# EAGLE board mainboard_split IO_FPGA_8x2-1a (EAGLE 9.6.2), part 1 of 2
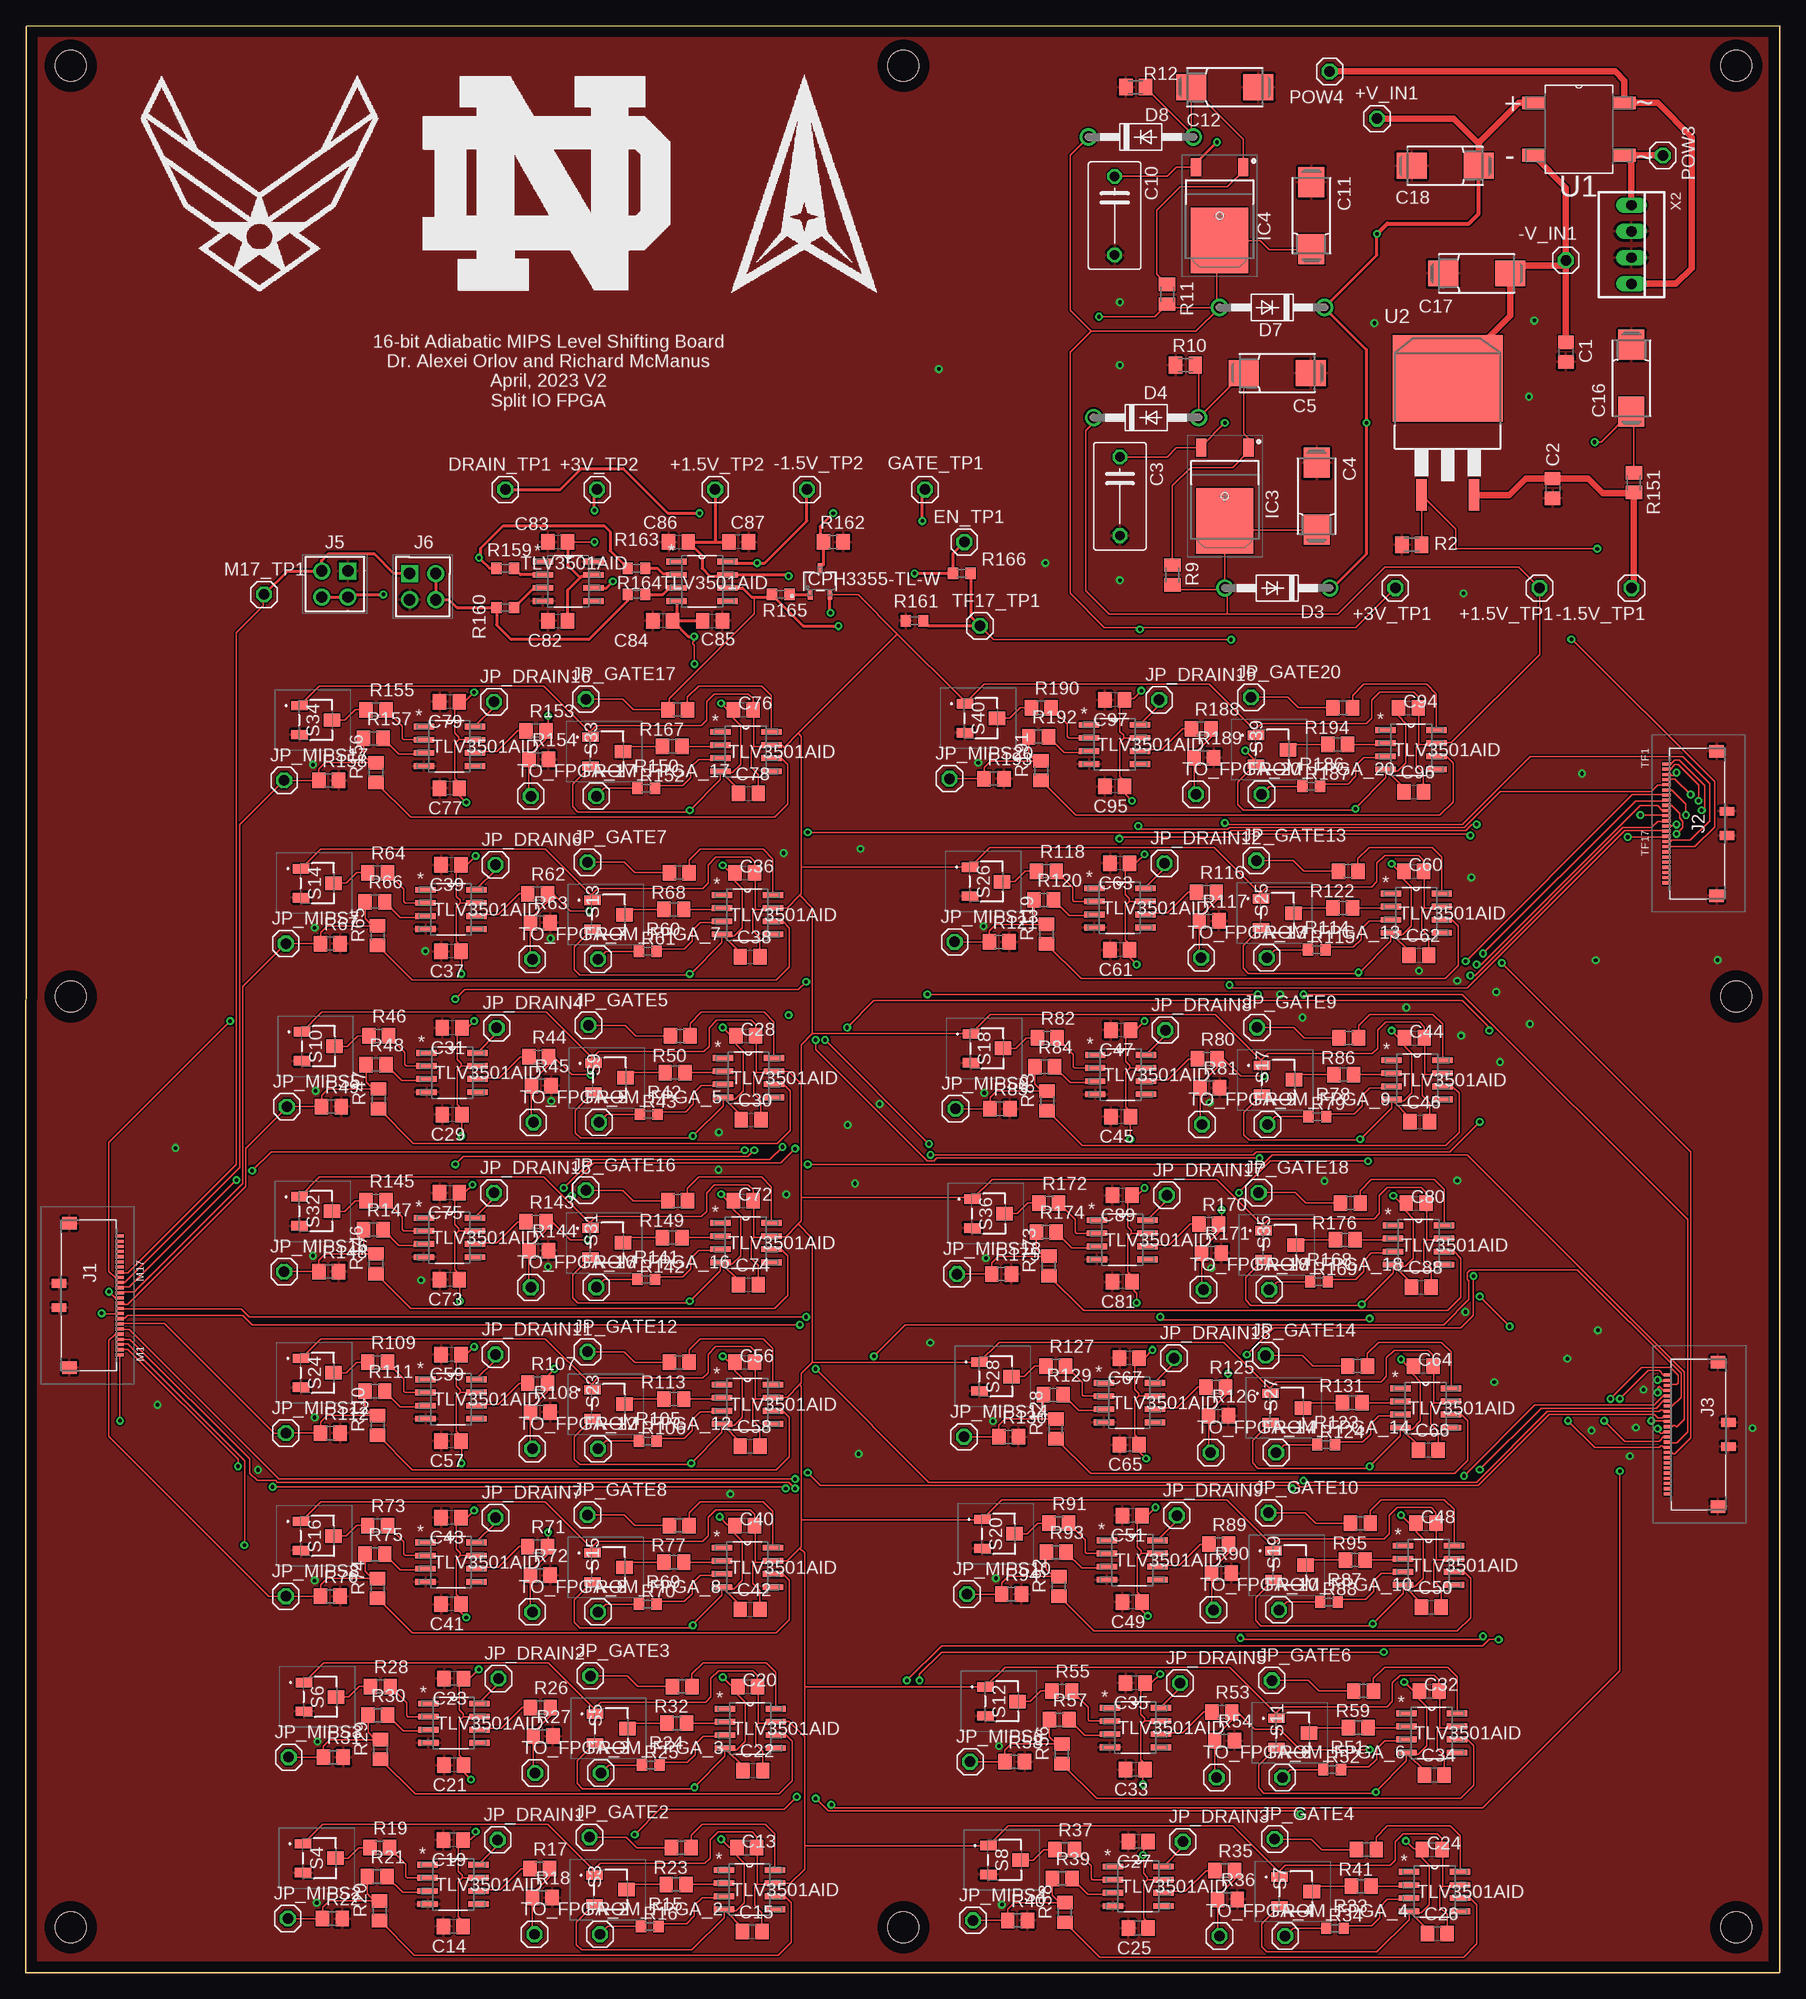
[diagram p17: board, top side]
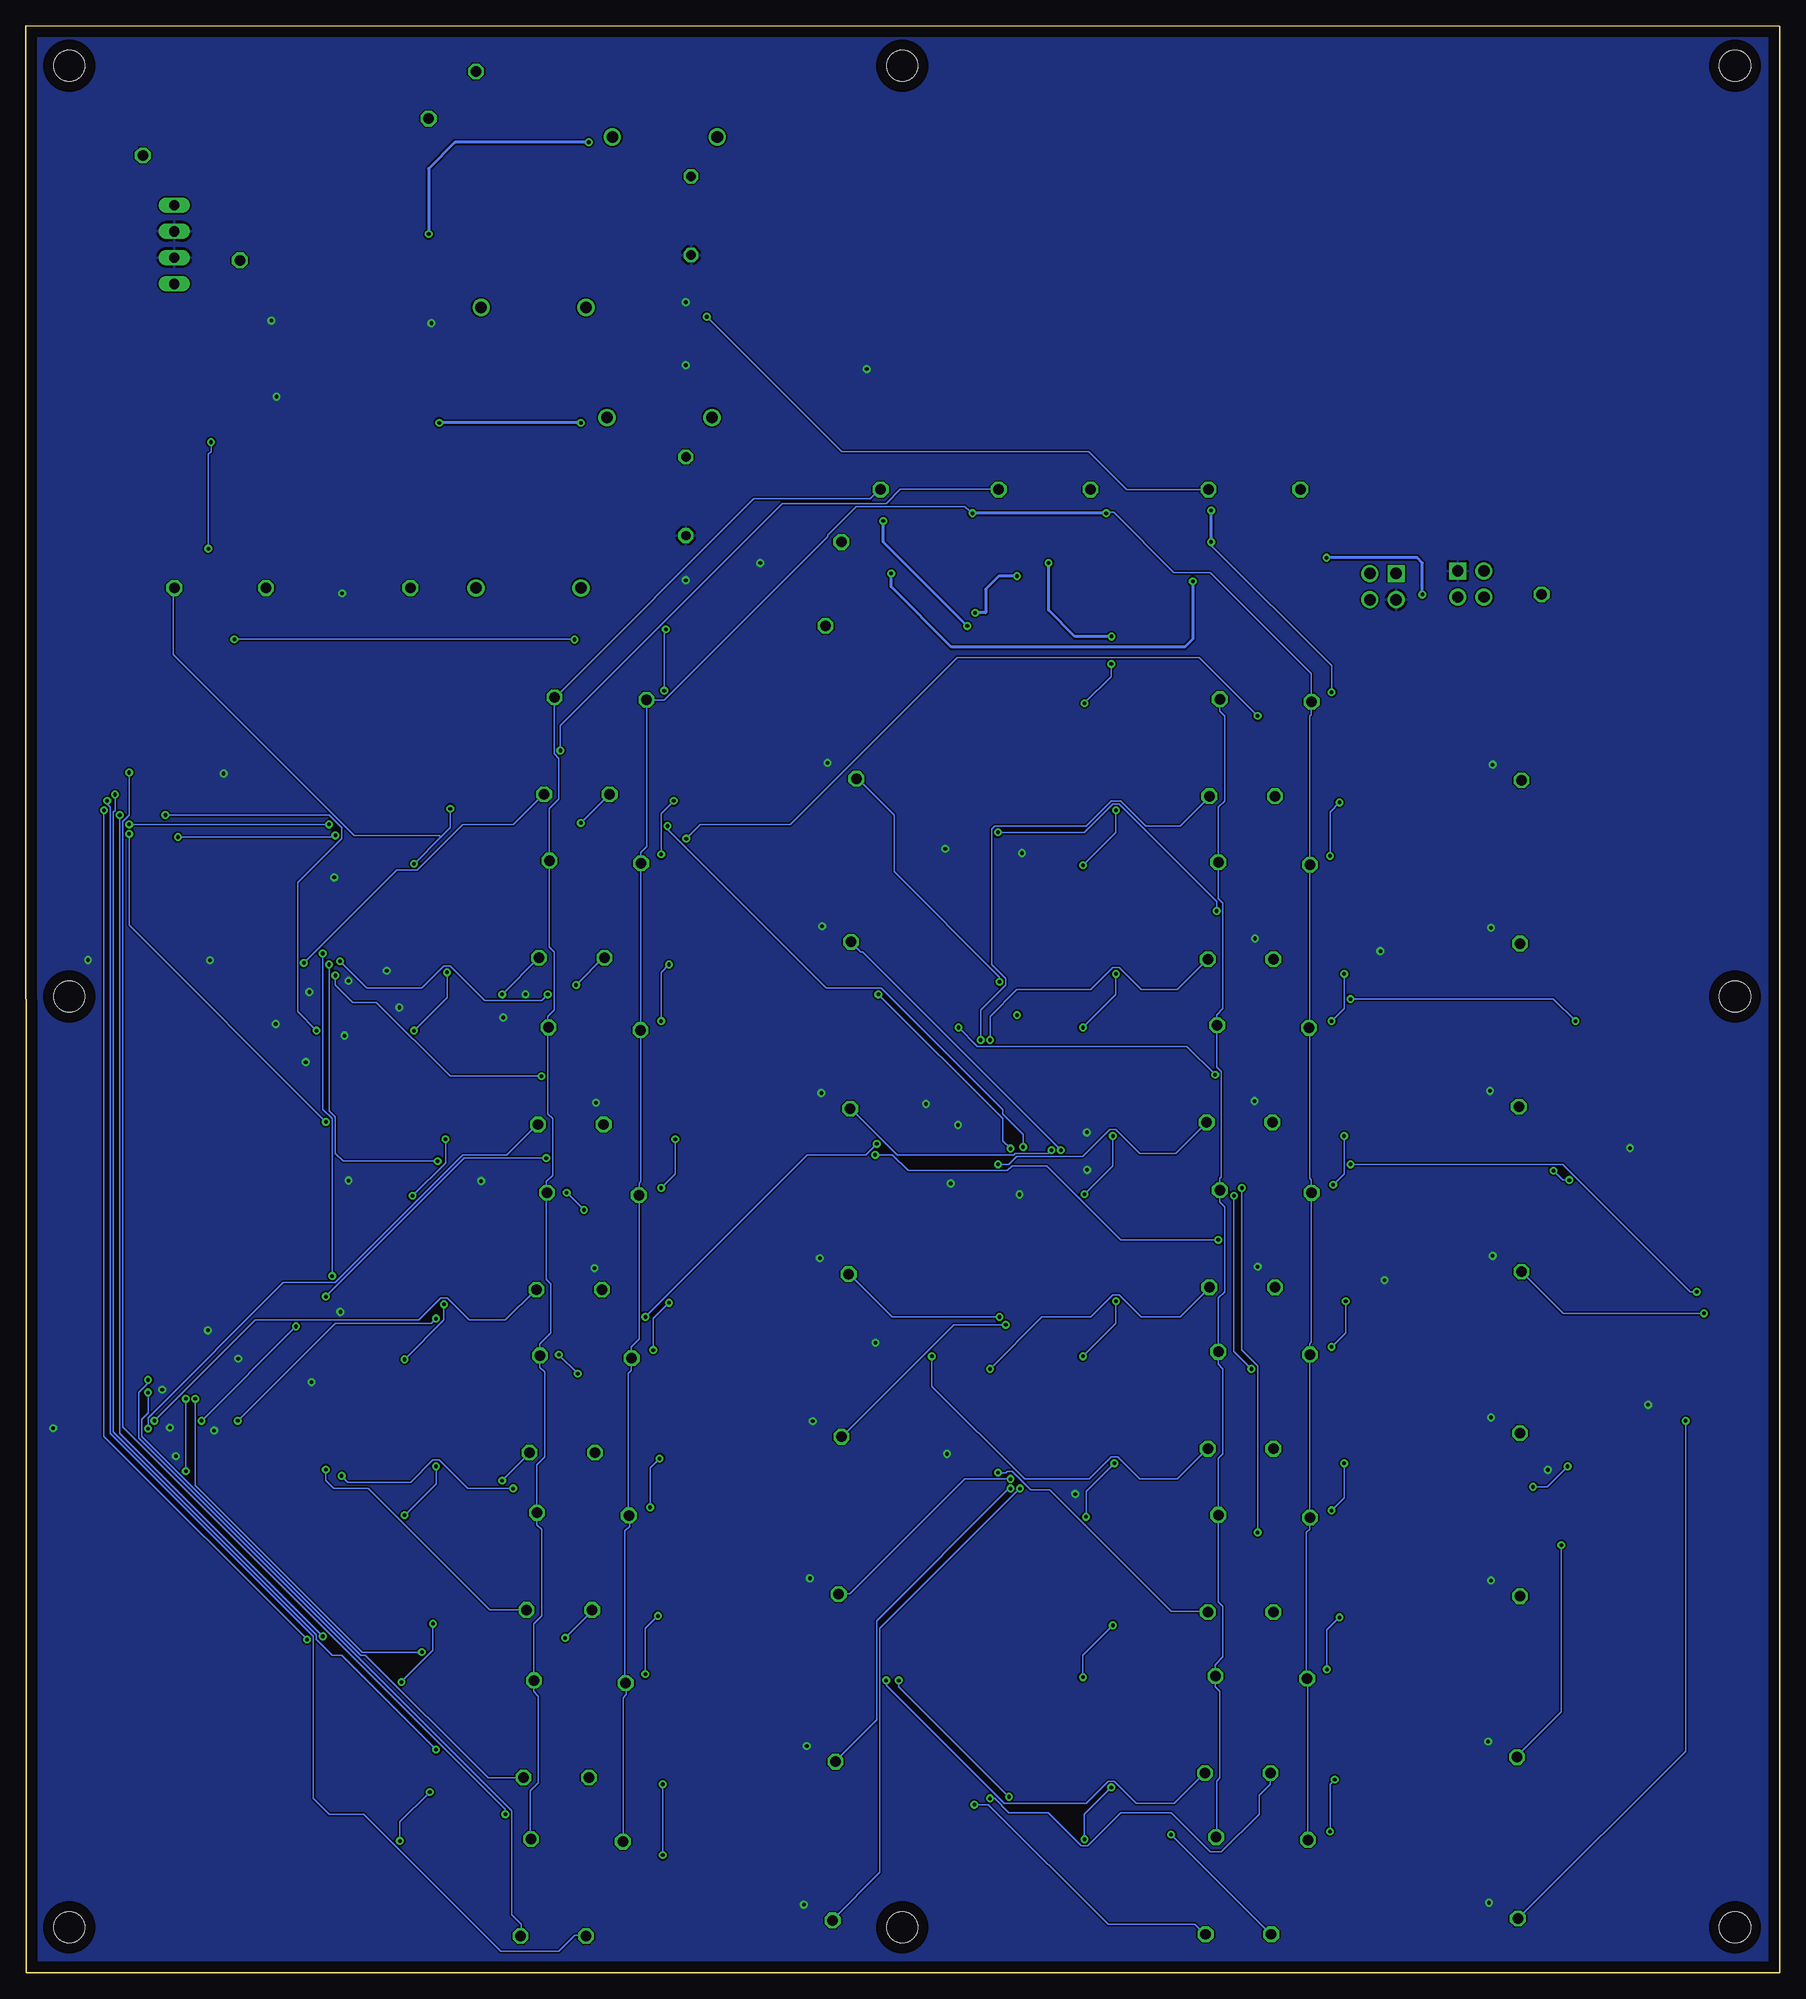
[diagram p18: board, bottom side, seen from below]

Size 169.85 x 188.59 mm. Coordinates in mm from the lower left corner, seen from the top.
Outline: 0,0 169.82,0.02 169.85,188.59 0.03,188.57 0,0
Copper layers (1*16): Top 0.035mm / dielectric 1.5mm / Bottom 0.035mm
Design rules "default *": minimum track width 6mil, minimum drill 0.35mm, track to track 6mil, track to pad 6mil, pad to pad 6mil, via to via 6mil, smd to smd 6mil, copper to edge 40mil, drill to drill 6mil, minimum pad ring 10mil, minimum via ring 8mil, stop-mask expansion 4mil, vias tented up to drill 15mil, thermal gap 10mil
Holes 3 mm at 165.63,4.41 4.34,4.41 84.99,4.41 4.34,184.75 165.63,184.75 84.99,184.75 4.34,94.58 165.63,94.58

## Footprints (pad centres in the part's own frame; a part is rotated, then mirrored left to right if it is on the bottom)
1X01 = drill 1.016 octagon: 1 0,0
C0805 = smd 1.3 x 1.5: 1 -0.95,0; 2 0.95,0
C075-052X106 = drill 0.914 octagon: 1 -3.81,0; 2 3.81,0
085CS_1AR = smd 2.9 x 2.5: + 3.25,0; - -3.25,0
DO41-10 = drill 1.118: A 5.08,0; C -5.08,0
TO228P991X238-3N = smd 1.75 x 1: 1 -4.7,2.285; 3 -4.7,-2.285 | smd 6.35 x 5.55: 4 2.4,0
5022442430 = smd 0.3 x 0.8: 1 5.75,3.08; 2 5.25,3.08; 3 4.75,3.08; 4 4.25,3.08; 5 3.75,3.08; 6 3.25,3.08; 7 2.75,3.08; 8 2.25,3.08; 9 1.75,3.08; 10 1.25,3.08; 11 0.75,3.08; 12 0.25,3.08; 13 -0.25,3.08; 14 -0.75,3.08; 15 -1.25,3.08; 16 -1.75,3.08; 17 -2.25,3.08; 18 -2.75,3.08; 19 -3.25,3.08; 20 -3.75,3.08; 21 -4.25,3.08; 22 -4.75,3.08; 23 -5.25,3.08; 24 -5.75,3.08 | smd 1.22 x 1.4: 25 -6.99,-1.77; 28 6.99,-1.77 | smd 0.85 x 1.4: 26 -1.175,-2.78; 27 1.175,-2.78
HDRV4W64P254_2X2_521X508X851P = drill 1.1 pad 1.65 square: 1 0,0 | drill 1.1 pad 1.65: 2 0,2.54; 3 2.54,0; 4 2.54,2.54
M0805 = smd 1.3 x 1.6: 1 -0.95,0; 2 0.95,0
R0805 = smd 1.3 x 1.5: 1 -0.95,0; 2 0.95,0
R0603 = smd 1 x 1.1: 1 -0.85,0; 2 0.85,0
SM3TW102 = smd 0.9 x 1.6: 1 -1.4,-1.56; 3 1.4,-1.56 | smd 1.3 x 1.6: 2 0,1.56
SOT508P985X260-4N = smd 2.235 x 1.245: 1 -4.394,2.54; 2 -4.394,-2.54; 3 4.394,-2.54; 4 4.394,2.54
D2PAK-3 = smd 1.016 x 3.05: 1 -2.54,-11.31; 3 2.54,-11.31 | smd 10.66 x 8.38: 4 0,0
D8 = smd 1.981 x 0.559: 1 -2.464,1.905; 2 -2.464,0.635; 3 -2.464,-0.635; 4 -2.464,-1.905; 5 2.464,-1.905; 6 2.464,-0.635; 7 2.464,0.635; 8 2.464,1.905
CPH3_2P9X1P6_ONS = smd 0.457 x 0.914: 1 -0.95,-1.295; 2 0.95,-1.295; 3 0,1.295
22-23-2041 = drill 1 long: 1 -3.81,0; 2 -1.27,0; 3 1.27,0; 4 3.81,0

## Placement (x,y rotation side)
+1.5V_TP1  [1X01]  146.58,134.14 180 top
+1.5V_TP2  [1X01]  66.75,143.68 0 top
+3V_TP1  [1X01]  132.61,134.14 180 top
+3V_TP2  [1X01]  55.32,143.68 0 top
+V_IN1  [1X01]  130.84,179.6 180 top
-1.5V_TP1  [1X01]  155.47,134.14 180 top
-1.5V_TP2  [1X01]  75.64,143.68 0 top
-V_IN1  [1X01]  149.12,165.89 180 top
C1  10uF  [C0805]  149.12,157 270 top
C2  0.1uF  [C0805]  147.85,143.79 270 top
C3  0.1uF  [C075-052X106]  105.94,143.03 270 top
C4  1uF  [085CS_1AR]  124.99,143.03 270 top
C5  10uF  [085CS_1AR]  121.18,154.97 180 top
C10  0.1uF  [C075-052X106]  105.44,170.21 270 top
C11  1uF  [085CS_1AR]  124.49,170.21 270 top
C12  10uF  [085CS_1AR]  116.1,182.65 180 top
C13  0.1uF  [C0805]  69.82,12.13 0 top
C14  0.1uF  [C0805]  41.38,4.51 180 top
C15  2.2uF  [C0805]  70.33,4 0 top
C16  1uF  [085CS_1AR]  155.47,154.46 90 top
C17  10uF  [085CS_1AR]  140.49,164.62 180 top
C18  10uF  [085CS_1AR]  137.44,175.03 0 top
C19  2.2uF  [C0805]  41.38,12.89 180 top
C20  0.1uF  [C0805]  69.9,27.75 0 top
C21  0.1uF  [C0805]  41.45,20.13 180 top
C22  2.2uF  [C0805]  70.41,19.62 0 top
C23  2.2uF  [C0805]  41.45,28.51 180 top
C24  0.1uF  [C0805]  136.17,11.95 0 top
C25  0.1uF  [C0805]  107.72,4.33 180 top
C26  2.2uF  [C0805]  136.68,3.82 0 top
C27  2.2uF  [C0805]  107.72,12.71 180 top
C28  0.1uF  [C0805]  69.72,90.77 0 top
C29  0.1uF  [C0805]  41.27,83.15 180 top
C30  2.2uF  [C0805]  70.23,82.64 0 top
C31  2.2uF  [C0805]  41.27,91.53 180 top
C32  0.1uF  [C0805]  135.89,27.32 0 top
C33  0.1uF  [C0805]  107.44,19.7 180 top
C34  2.2uF  [C0805]  136.4,19.19 0 top
C35  2.2uF  [C0805]  107.44,28.08 180 top
C36  0.1uF  [C0805]  69.62,106.57 0 top
C37  0.1uF  [C0805]  41.17,98.95 180 top
C38  2.2uF  [C0805]  70.13,98.44 0 top
C39  2.2uF  [C0805]  41.17,107.33 180 top
C40  0.1uF  [C0805]  69.62,43.35 0 top
C41  0.1uF  [C0805]  41.17,35.73 180 top
C42  2.2uF  [C0805]  70.13,35.22 0 top
C43  2.2uF  [C0805]  41.17,44.11 180 top
C44  0.1uF  [C0805]  134.47,90.56 0 top
C45  0.1uF  [C0805]  106.02,82.94 180 top
C46  2.2uF  [C0805]  134.98,82.44 0 top
C47  2.2uF  [C0805]  106.02,91.33 180 top
C48  0.1uF  [C0805]  135.59,43.55 0 top
C49  0.1uF  [C0805]  107.14,35.93 180 top
C50  2.2uF  [C0805]  136.09,35.42 0 top
C51  2.2uF  [C0805]  107.14,44.31 180 top
C56  0.1uF  [C0805]  69.62,59.14 0 top
C57  0.1uF  [C0805]  41.17,51.52 180 top
C58  2.2uF  [C0805]  70.13,51.02 0 top
C59  2.2uF  [C0805]  41.17,59.91 180 top
C60  0.1uF  [C0805]  134.39,106.72 0 top
C61  0.1uF  [C0805]  105.94,99.1 180 top
C62  2.2uF  [C0805]  134.9,98.59 0 top
C63  2.2uF  [C0805]  105.94,107.48 180 top
C64  0.1uF  [C0805]  135.31,58.79 0 top
C65  0.1uF  [C0805]  106.86,51.17 180 top
C66  2.2uF  [C0805]  135.81,50.66 0 top
C67  2.2uF  [C0805]  106.86,59.55 180 top
C72  0.1uF  [C0805]  69.47,74.79 0 top
C73  0.1uF  [C0805]  41.02,67.17 180 top
C74  2.2uF  [C0805]  69.98,66.66 0 top
C75  2.2uF  [C0805]  41.02,75.55 180 top
C76  0.1uF  [C0805]  69.47,122.36 0 top
C77  0.1uF  [C0805]  41.02,114.74 180 top
C78  2.2uF  [C0805]  69.98,114.24 0 top
C79  2.2uF  [C0805]  41.02,123.13 180 top
C80  0.1uF  [C0805]  134.62,74.56 0 top
C81  0.1uF  [C0805]  106.17,66.94 180 top
C82  2.2uF  [C0805]  51.51,130.98 0 top
C83  0.1uF  [C0805]  51.51,138.6 0 top
C84  0.1uF  [C0805]  61.67,130.98 180 top
C85  2.2uF  [C0805]  66.5,130.98 0 top
C86  0.1uF  [C0805]  63.2,138.6 0 top
C87  2.2uF  [C0805]  69.04,138.6 180 top
C88  2.2uF  [C0805]  135.13,66.43 0 top
C89  2.2uF  [C0805]  106.17,75.32 180 top
C94  0.1uF  [C0805]  133.88,122.54 0 top
C95  0.1uF  [C0805]  105.44,114.92 180 top
C96  2.2uF  [C0805]  134.39,114.41 0 top
C97  2.2uF  [C0805]  105.44,123.3 180 top
D3  1N4002  [DO41-10]  121.18,134.14 180 top
D4  1N4002  [DO41-10]  108.48,150.65 0 top
D7  1N4002  [DO41-10]  120.68,161.32 180 top
D8  1N4002  [DO41-10]  107.98,177.83 0 top
DRAIN_TP1  [1X01]  46.43,143.68 0 top
EN_TP1  [1X01]  90.88,138.6 0 top
FROM_FPGA_2  [1X01]  55.6,3.75 0 top
FROM_FPGA_3  [1X01]  55.68,19.37 0 top
FROM_FPGA_4  [1X01]  121.95,3.57 0 top
FROM_FPGA_5  [1X01]  55.5,82.38 0 top
FROM_FPGA_6  [1X01]  121.67,18.94 0 top
FROM_FPGA_7  [1X01]  55.4,98.18 0 top
FROM_FPGA_8  [1X01]  55.4,34.96 0 top
FROM_FPGA_9  [1X01]  120.24,82.18 0 top
FROM_FPGA_10  [1X01]  121.36,35.17 0 top
FROM_FPGA_12  [1X01]  55.4,50.76 0 top
FROM_FPGA_13  [1X01]  120.17,98.34 0 top
FROM_FPGA_14  [1X01]  121.08,50.41 0 top
FROM_FPGA_16  [1X01]  55.24,66.41 0 top
FROM_FPGA_17  [1X01]  55.24,113.98 0 top
FROM_FPGA_18  [1X01]  120.4,66.18 0 top
FROM_FPGA_20  [1X01]  119.66,114.16 0 top
GATE_TP1  [1X01]  87.07,143.68 0 top
IC3  LM317AMDT_NOPB  [TO228P991X238-3N]  116.1,143.03 270 top
IC4  LM317AMDT_NOPB  [TO228P991X238-3N]  115.6,170.21 270 top
J1  5022442430  [5022442430]  5.99,65.62 270 top
J2  5022442430  [5022442430]  161.95,111.34 90 top
J3  5022442430  [5022442430]  162.08,52.16 90 top
J5  70287-1098  [HDRV4W64P254_2X2_521X508X851P]  31.19,135.8 180 top
J6  70287-1098  [HDRV4W64P254_2X2_521X508X851P]  37.16,135.55 270 top
JP_DRAIN1  [1X01]  45.69,12.89 0 top
JP_DRAIN2  [1X01]  45.77,28.51 0 top
JP_DRAIN3  [1X01]  112.04,12.71 0 top
JP_DRAIN4  [1X01]  45.59,91.53 0 top
JP_DRAIN5  [1X01]  111.76,28.08 0 top
JP_DRAIN6  [1X01]  45.49,107.33 0 top
JP_DRAIN7  [1X01]  45.49,44.11 0 top
JP_DRAIN8  [1X01]  110.34,91.33 0 top
JP_DRAIN9  [1X01]  111.46,44.31 0 top
JP_DRAIN11  [1X01]  45.49,59.91 0 top
JP_DRAIN12  [1X01]  110.26,107.48 0 top
JP_DRAIN13  [1X01]  111.18,59.55 0 top
JP_DRAIN15  [1X01]  45.34,75.55 0 top
JP_DRAIN16  [1X01]  45.34,123.13 0 top
JP_DRAIN17  [1X01]  110.49,75.32 0 top
JP_DRAIN19  [1X01]  109.75,123.3 0 top
JP_GATE2  [1X01]  54.58,13.14 0 top
JP_GATE3  [1X01]  54.66,28.77 0 top
JP_GATE4  [1X01]  120.93,12.97 0 top
JP_GATE5  [1X01]  54.48,91.78 0 top
JP_GATE6  [1X01]  120.65,28.33 0 top
JP_GATE7  [1X01]  54.38,107.58 0 top
JP_GATE8  [1X01]  54.38,44.36 0 top
JP_GATE9  [1X01]  119.23,91.58 0 top
JP_GATE10  [1X01]  120.35,44.56 0 top
JP_GATE12  [1X01]  54.38,60.16 0 top
JP_GATE13  [1X01]  119.15,107.73 0 top
JP_GATE14  [1X01]  120.07,59.8 0 top
JP_GATE16  [1X01]  54.23,75.81 0 top
JP_GATE17  [1X01]  54.23,123.38 0 top
JP_GATE18  [1X01]  119.38,75.58 0 top
JP_GATE20  [1X01]  118.64,123.56 0 top
JP_MIPS2  [1X01]  25.37,5.27 0 top
JP_MIPS3  [1X01]  25.45,20.89 0 top
JP_MIPS4  [1X01]  91.72,5.09 0 top
JP_MIPS5  [1X01]  25.27,83.91 0 top
JP_MIPS6  [1X01]  91.44,20.46 0 top
JP_MIPS7  [1X01]  25.17,99.71 0 top
JP_MIPS8  [1X01]  25.17,36.49 0 top
JP_MIPS9  [1X01]  90.02,83.71 0 top
JP_MIPS10  [1X01]  91.14,36.69 0 top
JP_MIPS12  [1X01]  25.17,52.29 0 top
JP_MIPS13  [1X01]  89.94,99.86 0 top
JP_MIPS14  [1X01]  90.86,51.93 0 top
JP_MIPS16  [1X01]  25.02,67.93 0 top
JP_MIPS17  [1X01]  25.02,115.51 0 top
JP_MIPS18  [1X01]  90.17,67.7 0 top
JP_MIPS20  [1X01]  89.43,115.68 0 top
M17_TP1  [1X01]  23.06,133.52 0 top
POW3  [1X01]  158.52,176.05 180 top
POW4  [1X01]  126.26,184.18 180 top
R2  49Ω  [M0805]  134.2,138.34 0 top
R9  240Ω  [M0805]  111.02,135.41 270 top
R10  49Ω  [M0805]  112.29,155.73 0 top
R11  240Ω  [M0805]  110.52,162.59 270 top
R12  390Ω  [M0805]  107.47,182.65 0 top
R15  130  [R0805]  62.97,8.57 180 top
R16  130  [R0603]  60.43,4.51 0 top
R17  220  [R0805]  49.76,10.1 0 top
R18  220  [R0805]  50.01,7.3 0 top
R19  130  [R0805]  34.26,12.13 0 top
R20  220  [R0805]  34.26,6.03 90 top
R21  130  [R0805]  34.01,9.33 0 top
R22  220  [R0805]  29.69,5.27 0 top
R23  220  [R0805]  63.47,12.13 180 top
R24  130  [R0805]  63.04,24.19 180 top
R25  130  [R0603]  60.5,20.13 0 top
R26  220  [R0805]  49.83,25.72 0 top
R27  220  [R0805]  50.09,22.92 0 top
R28  130  [R0805]  34.34,27.75 0 top
R29  220  [R0805]  34.34,21.65 90 top
R30  130  [R0805]  34.09,24.96 0 top
R31  220  [R0805]  29.77,20.89 0 top
R32  220  [R0805]  63.55,27.75 180 top
R33  130  [R0805]  129.31,8.39 180 top
R34  130  [R0603]  126.77,4.33 0 top
R35  220  [R0805]  116.1,9.92 0 top
R36  220  [R0805]  116.36,7.12 0 top
R37  130  [R0805]  100.61,11.95 0 top
R38  220  [R0805]  100.61,5.85 90 top
R39  130  [R0805]  100.36,9.16 0 top
R40  220  [R0805]  96.04,5.09 0 top
R41  220  [R0805]  129.82,11.95 180 top
R42  130  [R0805]  62.87,87.21 180 top
R43  130  [R0603]  60.32,83.15 0 top
R44  220  [R0805]  49.66,88.73 0 top
R45  220  [R0805]  49.91,85.94 0 top
R46  130  [R0805]  34.16,90.77 0 top
R47  220  [R0805]  34.16,84.67 90 top
R48  130  [R0805]  33.91,87.97 0 top
R49  220  [R0805]  29.59,83.91 0 top
R50  220  [R0805]  63.37,90.77 180 top
R51  130  [R0805]  129.03,23.76 180 top
R52  130  [R0603]  126.49,19.7 0 top
R53  220  [R0805]  115.82,25.29 0 top
R54  220  [R0805]  116.08,22.49 0 top
R55  130  [R0805]  100.33,27.32 0 top
R56  220  [R0805]  100.33,21.22 90 top
R57  130  [R0805]  100.08,24.52 0 top
R58  220  [R0805]  95.76,20.46 0 top
R59  220  [R0805]  129.54,27.32 180 top
R60  130  [R0805]  62.76,103.01 180 top
R61  130  [R0603]  60.22,98.95 0 top
R62  220  [R0805]  49.56,104.53 0 top
R63  220  [R0805]  49.81,101.74 0 top
R64  130  [R0805]  34.06,106.57 0 top
R65  220  [R0805]  34.06,100.47 90 top
R66  130  [R0805]  33.81,103.77 0 top
R67  220  [R0805]  29.49,99.71 0 top
R68  220  [R0805]  63.27,106.57 180 top
R69  130  [R0805]  62.76,39.79 180 top
R70  130  [R0603]  60.22,35.73 0 top
R71  220  [R0805]  49.56,41.31 0 top
R72  220  [R0805]  49.81,38.52 0 top
R73  130  [R0805]  34.06,43.35 0 top
R74  220  [R0805]  34.06,37.25 90 top
R75  130  [R0805]  33.81,40.55 0 top
R76  220  [R0805]  29.49,36.49 0 top
R77  220  [R0805]  63.27,43.35 180 top
R78  130  [R0805]  127.61,87.01 180 top
R79  130  [R0603]  125.07,82.94 0 top
R80  220  [R0805]  114.4,88.53 0 top
R81  220  [R0805]  114.66,85.74 0 top
R82  130  [R0805]  98.91,90.56 0 top
R83  220  [R0805]  98.91,84.47 90 top
R84  130  [R0805]  98.65,87.77 0 top
R85  220  [R0805]  94.34,83.71 0 top
R86  220  [R0805]  128.12,90.56 180 top
R87  130  [R0805]  128.73,39.99 180 top
R88  130  [R0603]  126.19,35.93 0 top
R89  220  [R0805]  115.52,41.52 0 top
R90  220  [R0805]  115.77,38.72 0 top
R91  130  [R0805]  100.03,43.55 0 top
R92  220  [R0805]  100.03,37.45 90 top
R93  130  [R0805]  99.77,40.75 0 top
R94  220  [R0805]  95.45,36.69 0 top
R95  220  [R0805]  129.24,43.55 180 top
R105  130  [R0805]  62.76,55.59 180 top
R106  130  [R0603]  60.22,51.52 0 top
R107  220  [R0805]  49.56,57.11 0 top
R108  220  [R0805]  49.81,54.32 0 top
R109  130  [R0805]  34.06,59.14 0 top
R110  220  [R0805]  34.06,53.05 90 top
R111  130  [R0805]  33.81,56.35 0 top
R112  220  [R0805]  29.49,52.29 0 top
R113  220  [R0805]  63.27,59.14 180 top
R114  130  [R0805]  127.53,103.16 180 top
R115  130  [R0603]  124.99,99.1 0 top
R116  220  [R0805]  114.33,104.69 0 top
R117  220  [R0805]  114.58,101.89 0 top
R118  130  [R0805]  98.83,106.72 0 top
R119  220  [R0805]  98.83,100.62 90 top
R120  130  [R0805]  98.58,103.92 0 top
R121  220  [R0805]  94.26,99.86 0 top
R122  220  [R0805]  128.04,106.72 180 top
R123  130  [R0805]  128.45,55.23 180 top
R124  130  [R0603]  125.91,51.17 0 top
R125  220  [R0805]  115.24,56.76 0 top
R126  220  [R0805]  115.49,53.96 0 top
R127  130  [R0805]  99.75,58.79 0 top
R128  220  [R0805]  99.75,52.69 90 top
R129  130  [R0805]  99.49,55.99 0 top
R130  220  [R0805]  95.17,51.93 0 top
R131  220  [R0805]  128.96,58.79 180 top
R141  130  [R0805]  62.61,71.23 180 top
R142  130  [R0603]  60.07,67.17 0 top
R143  220  [R0805]  49.4,72.76 0 top
R144  220  [R0805]  49.66,69.96 0 top
R145  130  [R0805]  33.91,74.79 0 top
R146  220  [R0805]  33.91,68.69 90 top
R147  130  [R0805]  33.66,72 0 top
R148  220  [R0805]  29.34,67.93 0 top
R149  220  [R0805]  63.12,74.79 180 top
R150  130  [R0805]  62.61,118.81 180 top
R151  240Ω  [M0805]  155.7,144.34 270 top
R152  130  [R0603]  60.07,114.74 0 top
R153  220  [R0805]  49.4,120.33 0 top
R154  220  [R0805]  49.66,117.54 0 top
R155  130  [R0805]  33.91,122.36 0 top
R156  220  [R0805]  33.91,116.27 90 top
R157  130  [R0805]  33.66,119.57 0 top
R158  220  [R0805]  29.34,115.51 0 top
R159  220  [R0603]  46.43,136.06 0 top
R160  220  [R0603]  46.43,132.25 0 top
R161  220  [R0603]  86.06,130.98 0 top
R162  51  [R0805]  78.18,138.6 0 top
R163  220  [R0603]  59.13,136.06 0 top
R164  220  [R0603]  59.13,133.52 0 top
R165  220  [R0603]  73.1,133.52 0 top
R166  220  [R0603]  90.63,135.55 0 top
R167  220  [R0805]  63.12,122.36 180 top
R168  130  [R0805]  127.76,71.01 180 top
R169  130  [R0603]  125.22,66.94 0 top
R170  220  [R0805]  114.55,72.53 0 top
R171  220  [R0805]  114.81,69.74 0 top
R172  130  [R0805]  99.06,74.56 0 top
R173  220  [R0805]  99.06,68.47 90 top
R174  130  [R0805]  98.81,71.77 0 top
R175  220  [R0805]  94.49,67.7 0 top
R176  220  [R0805]  128.27,74.56 180 top
R186  130  [R0805]  127.03,118.99 180 top
R187  130  [R0603]  124.49,114.92 0 top
R188  220  [R0805]  113.82,120.51 0 top
R189  220  [R0805]  114.07,117.72 0 top
R190  130  [R0805]  98.32,122.54 0 top
R191  220  [R0805]  98.32,116.45 90 top
R192  130  [R0805]  98.07,119.75 0 top
R193  220  [R0805]  93.75,115.68 0 top
R194  220  [R0805]  127.53,122.54 180 top
S3  SM-3TW102  [SM3TW102]  56.62,8.06 270 top
S4  SM-3TW102  [SM3TW102]  28.42,11.11 270 top
S5  SM-3TW102  [SM3TW102]  56.69,23.69 270 top
S6  SM-3TW102  [SM3TW102]  28.5,26.73 270 top
S7  SM-3TW102  [SM3TW102]  122.96,7.89 270 top
S8  SM-3TW102  [SM3TW102]  94.77,10.93 270 top
S9  SM-3TW102  [SM3TW102]  56.51,86.7 270 top
S10  SM-3TW102  [SM3TW102]  28.32,89.75 270 top
S11  SM-3TW102  [SM3TW102]  122.68,23.25 270 top
S12  SM-3TW102  [SM3TW102]  94.49,26.3 270 top
S13  SM-3TW102  [SM3TW102]  56.41,102.5 270 top
S14  SM-3TW102  [SM3TW102]  28.22,105.55 270 top
S15  SM-3TW102  [SM3TW102]  56.41,39.28 270 top
S16  SM-3TW102  [SM3TW102]  28.22,42.33 270 top
S17  SM-3TW102  [SM3TW102]  121.26,86.5 270 top
S18  SM-3TW102  [SM3TW102]  93.07,89.55 270 top
S19  SM-3TW102  [SM3TW102]  122.38,39.48 270 top
S20  SM-3TW102  [SM3TW102]  94.18,42.53 270 top
S23  SM-3TW102  [SM3TW102]  56.41,55.08 270 top
S24  SM-3TW102  [SM3TW102]  28.22,58.13 270 top
S25  SM-3TW102  [SM3TW102]  121.18,102.65 270 top
S26  SM-3TW102  [SM3TW102]  92.99,105.7 270 top
S27  SM-3TW102  [SM3TW102]  122.1,54.72 270 top
S28  SM-3TW102  [SM3TW102]  93.9,57.77 270 top
S31  SM-3TW102  [SM3TW102]  56.26,70.73 270 top
S32  SM-3TW102  [SM3TW102]  28.07,73.77 270 top
S33  SM-3TW102  [SM3TW102]  56.26,118.3 270 top
S34  SM-3TW102  [SM3TW102]  28.07,121.35 270 top
S35  SM-3TW102  [SM3TW102]  121.41,70.5 270 top
S36  SM-3TW102  [SM3TW102]  93.22,73.55 270 top
S39  SM-3TW102  [SM3TW102]  120.68,118.48 270 top
S40  SM-3TW102  [SM3TW102]  92.48,121.53 270 top
TF17_TP1  [1X01]  92.41,130.47 0 top
TO_FPGA_2  [1X01]  49.25,3.75 0 top
TO_FPGA_3  [1X01]  49.33,19.37 0 top
TO_FPGA_4  [1X01]  115.6,3.57 0 top
TO_FPGA_5  [1X01]  49.15,82.38 0 top
TO_FPGA_6  [1X01]  115.32,18.94 0 top
TO_FPGA_7  [1X01]  49.05,98.18 0 top
TO_FPGA_8  [1X01]  49.05,34.96 0 top
TO_FPGA_9  [1X01]  113.89,82.18 0 top
TO_FPGA_10  [1X01]  115.01,35.17 0 top
TO_FPGA_12  [1X01]  49.05,50.76 0 top
TO_FPGA_13  [1X01]  113.82,98.34 0 top
TO_FPGA_14  [1X01]  114.73,50.41 0 top
TO_FPGA_16  [1X01]  48.9,66.41 0 top
TO_FPGA_17  [1X01]  48.9,113.98 0 top
TO_FPGA_18  [1X01]  114.05,66.18 0 top
TO_FPGA_20  [1X01]  113.31,114.16 0 top
U1  DF10S  [SOT508P985X260-4N]  150.39,178.59 0 top
U2  MC79GENERICD2T  [D2PAK-3]  137.69,154.46 0 top
U5  TLV3501AID  [D8]  70.08,8.06 0 top
U6  TLV3501AID  [D8]  41.38,8.57 0 top
U7  TLV3501AID  [D8]  70.15,23.69 0 top
U8  TLV3501AID  [D8]  41.45,24.19 0 top
U9  TLV3501AID  [D8]  136.42,7.89 0 top
U10  TLV3501AID  [D8]  107.72,8.39 0 top
U11  TLV3501AID  [D8]  69.98,86.7 0 top
U12  TLV3501AID  [D8]  41.27,87.21 0 top
U13  TLV3501AID  [D8]  136.14,23.25 0 top
U14  TLV3501AID  [D8]  107.44,23.76 0 top
U15  TLV3501AID  [D8]  69.88,102.5 0 top
U16  TLV3501AID  [D8]  41.17,103.01 0 top
U17  TLV3501AID  [D8]  69.88,39.28 0 top
U18  TLV3501AID  [D8]  41.17,39.79 0 top
U19  TLV3501AID  [D8]  134.72,86.5 0 top
U20  TLV3501AID  [D8]  106.02,87.01 0 top
U21  TLV3501AID  [D8]  135.84,39.48 0 top
U22  TLV3501AID  [D8]  107.14,39.99 0 top
U25  TLV3501AID  [D8]  69.88,55.08 0 top
U26  TLV3501AID  [D8]  41.17,55.59 0 top
U27  TLV3501AID  [D8]  134.65,102.65 0 top
U28  TLV3501AID  [D8]  105.94,103.16 0 top
U29  TLV3501AID  [D8]  135.56,54.72 0 top
U30  TLV3501AID  [D8]  106.86,55.23 0 top
U33  TLV3501AID  [D8]  69.72,70.73 0 top
U34  TLV3501AID  [D8]  41.02,71.23 0 top
U35  TLV3501AID  [D8]  69.72,118.3 0 top
U36  TLV3501AID  [D8]  41.02,118.81 0 top
U37  TLV3501AID  [D8]  134.87,70.5 0 top
U38  CPH3355-TL-W  [CPH3_2P9X1P6_ONS]  76.91,134.79 0 top
U39  TLV3501AID  [D8]  52.53,134.79 0 top
U40  TLV3501AID  [D8]  65.48,134.79 0 top
U41  TLV3501AID  [D8]  106.17,71.01 0 top
U44  TLV3501AID  [D8]  134.14,118.48 0 top
U45  TLV3501AID  [D8]  105.44,118.99 0 top
X2  22-23-2041  [22-23-2041]  155.47,167.41 270 top

## Tracks (layer width: path | path; a pad name or v marks a point on that pad's centre or on a via)
+1.5V  (via drill 0.35)
  Top 0.152: D4.C 103.4,150.14 102.64,149.38 102.64,133.88 104.93,131.6 116.36,131.6 | 116.36,131.6 127.03,131.6 131.6,136.17 144.55,136.17 +1.5V_TP1.1 146.58,127.7 138.05,119.16 136.68,119.16 U44.7 136.47,118.99 134.9,118.99 | 116.23,134.01 D3.A 116.1,139.72 116.36,139.98 116.36,140.37 IC3.4 117.01,139.72 124.94,139.72 C4.+ | 116.23,134.01 116.36,133.88 116.36,131.6 | R9.2 111.47,134.01 116.23,134.01 | C15.2 71.28,5.84 70.59,6.54 70.59,8.32 70.84,8.57 | 70.84,8.57 72.42,8.57 U5.7 72.67,8.67 74.04,8.67 75.41,10.05 75.41,12.33 | 70.84,8.57 70.84,12.06 C13.2 70.77,13.21 70.33,13.65 67.03,13.65 66.27,12.89 66.27,11.11 65.76,10.6 55.6,10.6 55.06,10.06 55.06,9.88 | S4.1 28.76,14.41 50.52,14.41 55.06,9.88 | 55.06,9.88 S3.1 | C26.2 137.63,5.67 136.93,6.36 136.93,8.14 137.19,8.39 | U9.7 138.76,8.39 137.19,8.39 | 137.19,8.39 137.19,11.88 C24.2 137.12,13.03 136.68,13.47 133.38,13.47 132.61,12.71 132.61,10.93 132.11,10.43 121.95,10.43 121.4,9.88 121.4,9.7 | 121.4,9.7 116.87,14.24 95.11,14.24 S8.1 93.09,12.33 75.41,12.33 | 121.4,9.7 S7.1 | C22.2 71.36,21.47 70.66,22.16 70.66,23.94 70.92,24.19 | 70.92,24.19 72.49,24.19 U7.7 72.67,24.37 73.89,24.37 75.26,23 | 70.92,24.19 70.92,27.68 C20.2 70.85,28.83 70.41,29.27 67.11,29.27 66.34,28.51 66.34,26.73 65.84,26.23 55.68,26.23 55.13,25.68 55.13,25.5 | S6.1 28.84,30.04 50.6,30.04 55.13,25.5 | 55.13,25.5 S5.1 | C34.2 137.35,21.03 136.65,21.73 136.65,23.51 136.91,23.76 | U13.7 138.48,23.76 136.91,23.76 | 136.91,23.76 136.91,27.25 C32.2 136.84,28.4 136.4,28.84 133.1,28.84 132.33,28.08 132.33,26.3 131.83,25.79 121.67,25.79 121.12,25.25 121.12,25.07
  Top 0.152: 121.12,25.07 116.59,29.6 94.83,29.6 S12.1 92.79,27.72 75.41,27.72 | 121.12,25.07 S11.1 | C42.2 71.08,37.06 70.38,37.76 70.38,39.53 70.64,39.79 | 70.64,39.79 72.21,39.79 U17.7 73.74,39.92 74.96,41.13 | 70.64,39.79 70.64,43.28 C40.2 70.57,44.43 70.13,44.87 66.83,44.87 66.07,44.11 66.07,42.33 65.56,41.82 55.4,41.82 54.85,41.28 54.85,41.09 | S16.1 28.56,45.63 50.32,45.63 54.85,41.09 | 54.85,41.09 S15.1 | C50.2 137.04,37.26 136.35,37.96 136.35,39.74 136.6,39.99 | U21.7 138.18,39.99 136.6,39.99 | 136.6,39.99 136.6,43.48 C48.2 136.54,44.63 136.09,45.07 132.79,45.07 132.03,44.31 132.03,42.53 131.52,42.02 121.36,42.02 120.82,41.48 120.82,41.3 | 120.82,41.3 116.28,45.83 94.53,45.83 S20.1 92.48,43.88 75.11,43.88 | 120.82,41.3 S19.1 | C58.2 71.08,52.86 70.38,53.56 70.38,55.33 70.64,55.59 | 70.64,55.59 72.21,55.59 U25.7 72.36,55.77 73.74,55.77 74.96,56.98 | 70.64,55.59 70.64,59.08 C56.2 70.57,60.23 70.13,60.67 66.83,60.67 66.07,59.91 66.07,58.13 65.56,57.62 55.4,57.62 54.85,57.08 54.85,56.89 | S24.1 28.56,61.43 50.32,61.43 54.85,56.89 | 54.85,56.89 S23.1 | C66.2 136.76,52.5 136.07,53.2 136.07,54.98 136.32,55.23 | U29.7 137.9,55.23 136.32,55.23 | 136.32,55.23 136.32,58.72 C64.2 136.26,59.87 135.81,60.31 132.51,60.31 131.75,59.55 131.75,57.77 131.24,57.26 121.08,57.26 120.54,56.72 120.54,56.54 | 120.54,56.54 116,61.07 94.25,61.07 S28.1 92.33,59.12 76.17,59.12 | 120.54,56.54 S27.1 | C74.2 70.93,68.51 70.23,69.2 70.23,70.98 70.49,71.23 | 70.49,71.23 72.06,71.23 U33.7 72.21,71.31 73.58,71.31 74.8,72.53 | 70.49,71.23 70.49,74.72 C72.2 70.42,75.87 69.98,76.31 66.68,76.31 65.91,75.55 65.91,73.77 65.41,73.27 55.25,73.27 54.7,72.72 54.7,72.54
  Top 0.152: S32.1 28.41,77.08 50.17,77.08 54.7,72.54 | 54.7,72.54 S31.1 | C88.2 136.08,68.28 135.38,68.97 135.38,70.75 135.64,71.01 | U37.7 137.21,71.01 135.64,71.01 | 135.64,71.01 135.64,74.5 C80.2 135.57,75.64 135.13,76.09 131.83,76.09 131.06,75.32 131.06,73.55 130.56,73.04 120.4,73.04 119.85,72.49 119.85,72.31 | 119.85,72.31 115.32,76.85 93.56,76.85 S36.1 91.57,74.97 91.41,75.12 75.11,75.12 | 119.85,72.31 S35.1 | C30.2 71.18,84.48 70.49,85.18 70.49,86.96 70.74,87.21 | 70.74,87.21 72.31,87.21 U11.7 72.52,87.31 73.89,87.31 74.96,86.25 | 70.74,87.21 70.74,90.7 C28.2 70.67,91.85 70.23,92.29 66.93,92.29 66.17,91.53 66.17,89.75 65.66,89.24 55.5,89.24 54.96,88.7 54.96,88.52 | S10.1 28.66,93.05 50.42,93.05 54.96,88.52 | 54.96,88.52 S9.1 | C46.2 135.93,84.28 135.23,84.98 135.23,86.75 135.48,87.01 | U19.7 137.06,87.01 135.48,87.01 | 135.48,87.01 135.48,90.5 C44.2 135.42,91.65 134.98,92.09 131.67,92.09 130.91,91.33 130.91,89.55 130.4,89.04 120.24,89.04 119.7,88.5 119.7,88.31 | 119.7,88.31 115.16,92.85 93.41,92.85 S18.1 91.41,90.97 76.17,90.97 | 119.7,88.31 S17.1 | C38.2 71.08,100.28 70.38,100.98 70.38,102.76 70.64,103.01 | 70.64,103.01 72.21,103.01 U15.7 72.36,103.16 73.74,103.16 74.96,104.38 | 70.64,103.01 70.64,106.5 C36.2 70.57,107.65 70.13,108.09 66.83,108.09 66.07,107.33 66.07,105.55 65.56,105.04 55.4,105.04 54.85,104.5 54.85,104.32 | S14.1 28.56,108.85 50.32,108.85 54.85,104.32 | 54.85,104.32 S13.1 | C62.2 135.85,100.43 135.15,101.13 135.15,102.91 135.41,103.16 | U27.7 136.98,103.16 135.41,103.16 | 135.41,103.16 135.41,106.65 C60.2 135.34,107.8 134.9,108.24 131.6,108.24 130.84,107.48 130.84,105.7 130.33,105.19 120.17,105.19 119.62,104.65 119.62,104.47
  Top 0.152: 119.62,104.47 115.09,109 93.33,109 S26.1 91.41,107.12 75.11,107.12 | 119.62,104.47 S25.1 | C78.2 70.93,116.08 70.23,116.78 70.23,118.55 70.49,118.81 | 70.49,118.81 72.06,118.81 U35.7 72.21,119.01 73.13,119.01 73.43,118.71 74.8,120.08 | 70.49,118.81 70.49,122.3 C76.2 70.42,123.45 69.98,123.89 66.68,123.89 65.91,123.13 65.91,121.35 65.41,120.84 55.25,120.84 54.7,120.3 54.7,120.11 | S34.1 28.41,124.65 50.17,124.65 54.7,120.11 | 54.7,120.11 S33.1 | C96.2 135.34,116.26 134.65,116.95 134.65,118.73 134.9,118.99 | 134.9,118.99 134.9,122.48 C94.2 134.83,123.62 134.39,124.07 131.09,124.07 130.33,123.3 130.33,121.53 129.82,121.02 119.66,121.02 119.12,120.47 119.12,120.29 | 119.12,120.29 114.58,124.83 92.82,124.83 S40.1 90.81,122.97 90.81,123.28 84.4,129.68 | 119.12,120.29 S39.1 | 75.41,12.33 75.41,22.85 75.26,23 | 74.8,72.53 75.11,72.83 75.11,75.12 | 75.11,75.12 75.11,86.09 74.96,86.25 | 74.8,72.53 76.17,71.16 76.17,59.12 | 76.17,59.12 75.11,58.05 75.11,57.14 74.96,56.98 | 74.96,56.98 75.11,56.83 75.11,43.88 | 75.11,43.88 75.11,41.29 74.96,41.13 | 75.26,23 75.41,23.15 75.41,27.72 | 75.41,27.72 75.41,40.68 74.96,41.13 | 76.17,90.97 75.11,89.9 75.11,86.4 74.96,86.25 | U38.2 80.59,133.49 84.4,129.68 | 74.8,120.08 84.4,129.68 | 74.96,104.38 75.11,104.53 75.11,107.12 | 75.11,107.12 75.11,119.77 74.8,120.08 | 76.17,90.97 76.17,103.16 74.96,104.38
  Top 0.305: 66.75,138.59 C86.2 65.48,137.26 65.48,136.05 66.24,135.29 67.82,135.29 U40.7 73.74,135.42 v73.86,135.29 | 66.75,138.59 C87.2 | v77.93,131.74 77.86,131.8 U38.2 | +1.5V_TP2.1 66.75,138.59
  Bottom 0.305: v73.86,135.29 75.64,135.29 76.91,134.02 76.91,131.74 v77.93,131.74
+3V  (via drill 0.35)
  Top 0.152: D7.A 113.31,159.03 103.15,159.03 | +3V_TP1.1 128.8,130.33 107.87,130.33 | 103.15,159.03 101.12,157 101.12,133.63 104.42,130.33 107.87,130.33 | C11.+ 124.43,166.9 120.42,166.9 119.52,167.8 IC4.4 115.34,167.8 115.34,161.57 D7.A | D8.C 101.12,176.05 101.12,161.06 103.15,159.03 | D7.A 110.84,161.32 R11.2 109.31,160.43 v103.91,160.43 | C83.2 v55.07,138.59 | 42.27,9.21 41.88,8.83 41.88,5.46 42.33,5.02 | 42.27,9.21 42.27,9.46 41.88,9.84 41.88,12.45 C19.1 42.34,12.94 43.1,12.94 43.56,13.4 v43.56,13.7 | 42.27,9.21 U6.7 | 108.61,9.03 108.23,8.65 108.23,5.28 108.67,4.84 | 108.61,9.03 108.61,9.28 108.23,9.66 108.23,11.42 | 108.23,11.42 108.23,12.27 C27.1 | 108.61,9.03 U10.7 | 42.34,24.83 41.96,24.45 41.96,21.08 42.4,20.64 | 42.34,24.83 42.34,25.08 41.96,25.46 41.96,28.07 C23.1 42.49,28.64 43.1,28.64 v43.87,29.4 | 42.34,24.83 U8.7 | 108.33,24.4 107.95,24.02 107.95,20.65 108.39,20.21 | 108.33,24.4 108.33,24.65 107.95,25.03 107.95,27.64 C35.1 108.48,28.18 109.09,28.18 v109.86,28.94 | 108.33,24.4 U14.7 | 42.06,40.42 41.68,40.04 41.68,36.67 42.12,36.23 | 42.06,40.42 42.06,40.68 41.68,41.06 41.68,43.66 C43.1 42.19,44.18 42.8,44.18 v43.41,44.79 | 42.06,40.42 U18.7 | 108.03,40.63 107.65,40.25 107.65,36.88 108.09,36.44 | 108.03,40.63 108.03,40.88 107.65,41.26 107.65,43.87 C51.1 108.18,44.34 108.64,44.34 v109.4,45.1 | 108.03,40.63 U22.7 | 42.06,56.22 41.68,55.84 41.68,52.47 42.12,52.03 | 42.06,56.22 42.06,56.48 41.68,56.86 41.68,59.46 C59.1 42.19,60.03 42.8,60.03 v43.41,60.64 | 42.06,56.22 U26.7 | 107.75,55.87 107.37,55.49 107.37,52.12 107.81,51.68 | 107.75,55.87 107.75,56.12 107.37,56.5 107.37,59.11 C67.1 107.87,59.58 108.33,59.58 v109.09,60.34
  Top 0.152: 107.75,55.87 U30.7 | 41.91,71.87 41.53,71.49 41.53,68.12 41.97,67.68 | 41.91,71.87 41.91,72.12 41.53,72.5 41.53,75.11 C75.1 42.04,75.58 42.49,75.58 v43.26,76.34 | 41.91,71.87 U34.7 | 107.06,71.64 106.68,71.26 106.68,67.89 107.12,67.45 | 107.06,71.64 107.06,71.89 106.68,72.28 106.68,74.88 C89.1 107.26,75.42 107.72,75.42 v108.33,76.03 | 107.06,71.64 U41.7 | 42.16,87.85 41.78,87.46 41.78,84.1 42.23,83.65 | 42.16,87.85 42.16,88.1 41.78,88.48 41.78,91.09 C31.1 42.34,91.58 42.8,91.58 v43.41,92.19 | 42.16,87.85 U12.7 | 106.91,87.64 106.53,87.26 106.53,83.89 106.97,83.45 | 106.91,87.64 106.91,87.9 106.53,88.28 106.53,90.88 C47.1 107.11,91.43 107.57,91.43 v108.33,92.19 | 106.91,87.64 U20.7 | 42.06,103.64 41.68,103.26 41.68,99.9 42.12,99.45 | 42.06,103.64 42.06,103.9 41.68,104.28 41.68,106.89 C39.1 42.19,107.43 42.8,107.43 v43.56,108.19 | 42.06,103.64 U16.7 | 106.83,103.8 106.45,103.42 106.45,100.05 106.89,99.61 | 106.83,103.8 106.83,104.05 106.45,104.43 106.45,107.04 C63.1 106.96,107.58 107.57,107.58 v108.33,108.34 | 106.83,103.8 U28.7 | 41.91,119.44 41.53,119.06 41.53,115.69 41.97,115.25 | 41.91,119.44 41.91,119.7 41.53,120.08 41.53,122.68 C79.1 42.49,123.13 v43.41,124.04 | 41.91,119.44 U36.7 | 106.32,119.62 105.94,119.24 105.94,115.87 106.39,115.43 | 106.32,119.62 106.32,119.87 105.94,120.26 105.94,122.86 C97.1 106.5,123.43 107.26,123.43 v108.03,124.19 | 106.32,119.62 U45.7 | v43.1,18.73 42.49,19.34 42.49,20.1 C21.1 | v42.04,65.06 42.04,67.04 C73.1 | v42.19,49.36 42.19,51.5 C57.1 | v42.65,34.43 42.04,35.04 42.04,35.65 C41.1 | v42.19,81.06 42.19,83.04 C29.1 | v42.19,96.76 42.19,98.89 C37.1
  Top 0.152: v108.18,18.27 108.18,19.49 108.33,19.65 C33.1 | v108.18,11.42 108.23,11.42 | v108.48,49.82 107.87,50.43 107.87,51.04 C65.1 | v107.57,64.91 107.57,65.82 107.26,66.13 107.26,66.89 C81.1 | v106.96,80.76 106.96,82.89 C45.1 | v108.64,34.58 108.03,35.19 108.03,35.8 C49.1 | 107.87,130.33 v107.87,130.14 | v107.11,113.52 106.5,114.13 106.5,114.9 C95.1 | v107.57,97.68 106.96,98.28 106.96,99.05 C61.1 | v42.65,113.37 42.04,113.98 42.04,114.74 C77.1
  Top 0.203: C14.1 42.33,5.02 | C25.1 108.67,4.84 | C21.1 42.4,20.64 | C33.1 108.39,20.21 | C41.1 42.12,36.23 | C49.1 108.09,36.44 | C57.1 42.12,52.03 | C65.1 107.81,51.68 | C73.1 41.97,67.68 | C81.1 107.12,67.45 | C29.1 42.23,83.65 | C45.1 106.97,83.45 | C37.1 42.12,99.45 | C61.1 106.89,99.61 | C77.1 41.97,115.25 | C95.1 106.39,115.43
  Top 0.305: C82.2 52.46,133.96 53.67,135.17 | U39.7 54.86,135.29 53.8,135.29 53.67,135.17 | C83.2 52.46,136.37 53.67,135.17 | v55.07,141.64 55.07,143.42 +3V_TP2.1
  Bottom 0.152: +3V_TP2.1 63.26,143.67 66.94,147.36 90.84,147.36 v103.91,160.43 | v43.56,13.7 43.56,18.27 v43.1,18.73 | v42.04,65.06 42.04,62.01 v43.41,60.64 | v42.19,49.36 42.19,46.01 v43.41,44.79 | v43.87,29.4 43.87,33.21 v42.65,34.43 | v42.19,81.06 42.19,77.41 v43.26,76.34 | v42.19,96.76 42.19,93.41 v43.41,92.19 | v108.18,18.27 v108.18,11.42 | v109.4,45.1 109.4,48.91 v108.48,49.82 | v109.09,60.34 109.09,63.39 v107.57,64.91 | v106.96,80.76 106.96,77.41 v108.33,76.03 | v109.86,28.94 109.86,33.36 v108.64,34.58 | v43.41,124.04 43.41,126.63 54.99,138.21 54.99,138.52 v55.07,138.59 | v108.03,124.19 108.03,129.98 v107.87,130.14 | v108.33,108.34 108.33,112.31 v107.11,113.52 | v108.33,92.19 108.33,96.91 v107.57,97.68 | v43.56,108.19 43.56,112.46 v42.65,113.37
  Bottom 0.305: v55.07,138.59 v55.07,141.64
-1.5V  (via drill 0.35)
  Top 0.152: -1.5V_TP1.1 155.47,134.26 155.7,134.37 | 67.77,6.01 U5.4 67.61,5.35 64.49,2.22 53.82,2.22 53.31,2.73 53.31,4.92 S3.3 | 67.77,6.01 69.38,4.39 C15.1 | 67.77,6.01 68.78,6.01 69.57,6.79 69.57,10.6 68.87,11.3 C13.1 68.86,12.18 68.1,12.18 v67.34,12.94 | 134.11,5.83 U9.4 133.96,5.17 130.84,2.04 120.17,2.04 119.66,2.55 119.66,4.74 S7.3 | 134.11,5.83 135.73,4.21 C26.1 | 134.11,5.83 135.13,5.83 135.92,6.62 135.92,10.43 135.22,11.12 C24.1 135.15,12.03 134.39,12.03 v133.63,12.79 | 67.84,21.63 U7.4 67.69,20.97 64.72,18 | 67.84,21.63 69.46,20.01 C22.1 | S5.3 53.39,20.54 53.39,18.35 53.9,17.84 64.57,17.84 64.72,18 | 67.84,21.63 68.86,21.63 69.65,22.42 69.65,26.23 68.95,26.92 C20.1 68.86,27.88 68.25,27.88 v67.49,28.64 | 133.83,21.2 U13.4 133.68,20.54 130.7,17.55 | 133.83,21.2 135.45,19.58 C34.1 | S11.3 119.38,20.11 119.38,17.92 119.89,17.41 130.56,17.41 130.7,17.55 | 133.83,21.2 134.85,21.2 135.64,21.98 135.64,25.79 134.94,26.49 C32.1 134.85,27.42 134.24,27.42 v133.48,28.18 | 67.56,37.22 U17.4 67.41,36.56 64.55,33.71 | 67.56,37.22 69.18,35.61 C42.1 | S15.3 53.11,36.14 53.11,33.95 53.62,33.44 64.29,33.44 64.55,33.71 | 67.56,37.22 68.58,37.22 69.37,38.01 69.37,41.82 68.67,42.52 C40.1 68.55,43.42 67.95,43.42 v67.18,44.18 | 133.53,37.43 U21.4 133.38,36.77 v130.43,33.82 130.25,33.64 119.58,33.64 119.08,34.15 119.08,36.34 S19.3 | 133.53,37.43 135.14,35.81 C50.1 | 133.53,37.43 134.54,37.43 135.33,38.21 135.33,42.02 134.64,42.72 C48.1 134.54,43.57 133.93,43.57 v133.17,44.34 | 67.56,53.02 U25.4 67.41,52.36 64.43,49.38 | 67.56,53.02 69.18,51.41 C58.1 | S23.3 53.11,51.94 53.11,49.75 53.62,49.24 64.29,49.24 64.43,49.38
  Top 0.152: 67.56,53.02 68.58,53.02 69.37,53.81 69.37,57.62 68.67,58.32 C56.1 68.55,59.12 68.1,59.12 v67.49,59.73 | 133.25,52.67 U29.4 133.1,52.01 130.14,49.05 | 133.25,52.67 134.86,51.05 C66.1 | S27.3 118.8,51.58 118.8,49.39 119.3,48.88 129.97,48.88 130.14,49.05 | 133.25,52.67 134.26,52.67 135.05,53.45 135.05,57.26 134.36,57.96 C64.1 134.24,58.81 133.78,58.81 v133.17,59.42 | 67.41,68.67 U33.4 67.26,68.01 64.3,65.05 | 67.41,68.67 69.03,67.05 C74.1 | S31.3 52.96,67.58 52.96,65.39 53.47,64.88 64.14,64.88 64.3,65.05 | 67.41,68.67 68.43,68.67 69.22,69.46 69.22,73.27 68.52,73.96 C72.1 68.4,74.82 67.95,74.82 v67.34,75.42 | 132.56,68.44 U37.4 132.41,67.78 129.38,64.74 | 132.56,68.44 134.18,66.82 C88.1 | S35.3 118.11,67.36 118.11,65.16 118.62,64.66 129.29,64.66 129.38,64.74 | 132.56,68.44 133.58,68.44 134.37,69.23 134.37,73.04 133.67,73.73 C80.1 133.63,74.66 133.02,74.66 v132.41,75.27 | 67.67,84.65 U11.4 67.51,83.98 v64.59,81.06 64.39,80.86 53.72,80.86 53.21,81.37 53.21,83.56 S9.3 | 67.67,84.65 69.28,83.03 C30.1 | 67.67,84.65 68.68,84.65 69.47,85.43 69.47,89.24 68.77,89.94 C28.1 68.71,90.82 68.25,90.82 v67.49,91.58 | 132.41,84.44 U19.4 132.26,83.78 v129.22,80.75 | 132.41,84.44 134.03,82.83 C46.1 | S17.3 117.96,83.36 117.96,81.17 118.47,80.66 129.13,80.66 v129.22,80.75 | 132.41,84.44 133.43,84.44 134.21,85.23 134.21,89.04 133.52,89.74 C44.1 133.48,90.66 132.87,90.66 v132.26,91.27 | 67.56,100.44 U15.4 67.41,99.78 64.34,96.71 | 67.56,100.44 69.18,98.83 C38.1 | S13.3 53.11,99.36 53.11,97.17 53.62,96.66 64.29,96.66 64.34,96.71 | 67.56,100.44 68.58,100.44 69.37,101.23 69.37,105.04 68.67,105.74 C36.1 68.55,106.67 68.1,106.67 v67.49,107.28
  Top 0.152: 132.33,100.6 U27.4 132.18,99.94 129.11,96.86 | 132.33,100.6 133.95,98.98 C62.1 | S25.3 117.88,99.51 117.88,97.32 118.39,96.81 129.06,96.81 129.11,96.86 | 132.33,100.6 133.35,100.6 134.14,101.38 134.14,105.19 133.44,105.89 C60.1 133.32,106.82 132.87,106.82 v132.26,107.43 | 67.41,116.24 U35.4 67.26,115.58 v64.29,112.61 64.14,112.46 53.47,112.46 52.96,112.97 52.96,115.16 S33.3 | 67.41,116.24 69.03,114.63 C78.1 | 67.41,116.24 68.43,116.24 69.22,117.03 69.22,120.84 68.52,121.54 C76.1 67.95,122.36 v67.34,122.97 | 131.83,116.42 U44.4 131.67,115.76 128.71,112.8 | 131.83,116.42 133.44,114.81 C96.1 | 128.71,112.8 128.55,112.64 117.88,112.64 117.37,113.14 117.37,115.34 S39.3 119,117.18 119,117.49 v118.08,118.4 | C94.1 132.93,121.71 133.63,121.02 133.63,117.21 132.84,116.42 131.83,116.42 | v64.74,17.97 64.72,18 | v64.59,33.67 64.55,33.71 | v64.44,49.36 64.43,49.38 | v64.29,65.06 64.3,65.05 | v64.29,96.76 64.34,96.71 | v64.74,126.78 64.74,128.61 64.59,128.76 64.59,128.92 64.74,129.07 64.74,129.37 v64.72,129.45 | v129.36,64.76 129.38,64.74 | v130.12,49.06 130.14,49.05 | v129.21,80.76 v129.22,80.75 | v129.06,96.91 129.11,96.86 | v128.75,112.76 128.71,112.8 | v130.73,17.51 130.7,17.55
  Top 0.305: C84.1 63.02,131.37 U40.4 | C84.1 C85.1 | U40.8 68.07,136.56 v70.82,136.56 71.58,136.56 75.64,140.63 -1.5V_TP2.1 | C84.1 64.15,129.45 v64.72,129.45
  Top 0.61: U2.3 143.66,143.15 145.25,144.74 C2.1 151.3,144.74 152.7,143.35 155.66,143.35 R151.2 155.7,134.37
  Bottom 0.152: v67.34,12.94 67.34,15.38 v64.74,17.97 | v67.49,28.64 67.49,30.77 v64.59,33.67 | v67.18,44.18 67.18,46.62 v64.44,49.36 | v64.29,65.06 64.29,62.93 v67.49,59.73 | v64.59,81.06 64.59,78.17 v67.34,75.42 | v64.29,96.76 64.29,94.78 v67.49,91.58 | v64.29,112.61 64.29,110.48 v67.49,107.28 | v64.74,126.78 64.74,125.56 v67.34,122.97 | v129.36,64.76 129.36,63.23 v133.17,59.42 | v130.12,49.06 130.12,47.38 v133.17,44.34 | v130.43,33.82 130.43,31.23 v133.48,28.18 | v129.21,80.76 129.21,78.47 v132.41,75.27 | v129.06,96.91 129.06,94.47 v132.26,91.27 | v128.75,112.76 128.75,110.93 129.67,110.02 | v132.26,107.43 129.67,110.02 | v133.63,12.79 133.63,14.62 v130.73,17.51 | 129.67,110.02 129.82,110.17 138.05,110.17 155.58,127.7 155.58,134.1 -1.5V_TP1.1 | v118.08,118.4 118.08,120.84 96.6,142.33 86.54,142.33 85.17,143.7 75.72,143.7 -1.5V_TP2.1
  Bottom 0.305: v64.72,129.45 68.28,129.45 70.82,131.99 v70.82,136.56
DIR_GATE  (via drill 0.35)
  Top 0.152: JP_GATE2.1 58.14,13.14 59.16,12.13 R23.2 | JP_GATE4.1 124.49,12.97 125.5,11.95 R41.2 | JP_GATE3.1 58.22,28.77 59.23,27.75 R32.2 | JP_GATE6.1 124.21,28.33 125.22,27.32 R59.2 | JP_GATE8.1 57.94,44.36 58.95,43.34 R77.2 | JP_GATE10.1 123.9,44.56 124.92,43.55 R95.2 | JP_GATE12.1 57.94,60.16 58.95,59.14 R113.2 | JP_GATE14.1 123.62,59.8 124.64,58.79 R131.2 | JP_GATE16.1 57.79,75.81 58.8,74.79 R149.2 | JP_GATE18.1 122.94,75.58 123.95,74.56 R176.2 | JP_GATE5.1 58.04,91.78 59.06,90.77 R50.2 | JP_GATE9.1 122.78,91.58 123.8,90.56 R86.2 | JP_GATE7.1 57.94,107.58 58.95,106.57 R68.2 | JP_GATE13.1 122.71,107.73 123.72,106.72 R122.2 | JP_GATE17.1 57.79,123.38 58.8,122.36 R167.2 62.31,122.36 62.31,123.43 70.54,131.66 70.54,133.26 | JP_GATE20.1 122.2,123.56 123.22,122.54 R194.2
  Top 0.305: U40.6 69.42,134.15 70.31,133.26 70.54,133.26 72,133.26 R165.1 75.3,130.47 v78.69,130.47 | v86.82,140.63 86.82,143.42 GATE_TP1.1
  Bottom 0.152: 120.68,28.33 120.68,27.27 120.22,26.81 120.22,18.43 120.98,17.67 120.98,13.09 JP_GATE4.1 | 119.46,75.58 119.46,67.2 119,66.74 119,62.01 120.07,60.95 JP_GATE14.1 120.07,58.66 119.61,58.2 119.61,49.97 120.37,49.21 120.37,44.64 JP_GATE10.1 120.37,44.49 120.37,43.42 119.91,42.96 119.91,34.58 120.68,33.82 120.68,28.33 | 119.3,91.58 119.3,83.2 118.85,82.74 118.85,77.25 119.46,76.64 119.46,75.58 | 119.46,75.58 JP_GATE18.1 | 120.68,28.33 JP_GATE6.1 | 119.3,91.58 119.3,92.65 118.69,93.26 118.69,98.89 119.15,99.35 JP_GATE13.1 119.15,112.76 118.24,113.68 118.24,117.64 118.69,118.1 118.69,123.43 JP_GATE20.1 118.54,123.58 99.34,142.79 88.06,142.79 87.15,143.7 GATE_TP1.1 | 119.3,91.58 JP_GATE9.1 | JP_GATE17.1 54.23,122.21 53.77,121.75 53.77,113.52 54.38,112.92 JP_GATE7.1 54.38,104.08 53.92,103.62 53.92,93.41 54.53,92.8 54.53,91.88 JP_GATE5.1 54.53,91.73 54.53,87.77 54.08,87.31 54.08,77.1 54.23,76.95 JP_GATE16.1 54.23,74.66 53.77,74.21 53.77,65.98 54.38,65.37 JP_GATE12.1 54.38,58.97 53.92,58.51 53.92,50.28 54.38,49.82 JP_GATE8.1 54.38,35.95 53.92,35.5 53.92,30.62 54.69,29.86 54.69,28.79 JP_GATE3.1 54.69,28.64 54.69,27.72 54.23,27.27 54.23,18.88 54.53,18.58 54.53,13.25 JP_GATE2.1
  Bottom 0.305: v78.69,130.47 86.82,138.59 v86.82,140.63
F1  (via drill 0.35)
  Top 0.152: FROM_FPGA_2.1 56.36,4.51 R16.1 | v154.36,55.61 157.1,58.36 158.17,58.36 158.62,57.9 158.93,57.9 J3.1 | v154.36,48.6 154.36,29.25 141.1,15.99 78.31,15.99 v78,16.29
  Bottom 0.152: v154.36,48.6 v154.36,55.61 | v78,16.29 76.63,16.29 65.05,4.71 56.67,4.71 55.6,3.64 FROM_FPGA_2.1
F2  (via drill 0.35)
  Top 0.152: FROM_FPGA_4.1 122.71,4.33 R34.1 | v158.01,57.44 158.17,57.29 158.47,57.29 158.62,57.44 158.93,57.44 J3.2
  Bottom 0.152: v158.01,57.44 158.01,57.14 158.93,56.22 158.93,51.8 122.81,15.68 122.81,5.63 121.89,4.71 121.89,3.64 FROM_FPGA_4.1
F3  (via drill 0.35)
  Top 0.152: FROM_FPGA_3.1 56.44,20.13 R25.1 | v153.44,55.61 156.49,58.66 159.23,58.66 159.99,57.9 159.99,57.14 159.84,56.98 159.08,56.98 J3.3 | v131.5,31.08 88.67,31.08 86.54,28.94 v86.54,28.33
  Bottom 0.152: v153.44,55.61 153.44,47.23 137.29,31.08 v131.5,31.08 | v86.54,28.33 86.54,27.88 75.11,16.45 67.18,16.45 65.05,18.58 64.44,18.58 62.31,16.45 58.65,16.45 55.75,19.34 FROM_FPGA_3.1
F4  (via drill 0.35)
  Top 0.152: FROM_FPGA_6.1 122.43,19.7 R52.1 | v158.01,56.22 158.01,56.68 158.17,56.83 158.62,56.37 158.93,56.37 J3.4
  Bottom 0.152: v158.01,56.22 158.01,54.24 158.62,53.63 158.62,51.96 137.44,30.77 136.98,30.77 125.1,18.88 121.74,18.88 FROM_FPGA_6.1
F5  (via drill 0.35)
  Top 0.152: FROM_FPGA_8.1 56.16,35.72 R70.1 | v139.27,48.15 146.13,55 157.71,55 158.62,55.92 158.93,55.92 J3.5 | v122.66,46.93 122.35,47.23 76.94,47.23 v75.72,48.45
  Bottom 0.152: v139.27,48.15 138.66,47.54 132.56,47.54 130.43,49.67 129.82,49.67 127.08,46.93 v122.66,46.93 | v75.72,48.45 74.96,48.45 74.8,48.6 74.35,48.6 72.52,46.77 70.69,46.77 58.95,35.04 55.45,35.04 FROM_FPGA_8.1
F6  (via drill 0.35)
  Top 0.152: FROM_FPGA_10.1 122.12,35.93 R88.1 | v140.79,48.75 146.74,54.7 157.86,54.7 158.62,55.46 158.93,55.46 J3.6
  Bottom 0.152: v140.79,48.75 140.79,47.69 140.03,46.93 136.68,46.93 124.94,35.19 121.44,35.19 FROM_FPGA_10.1
F7  (via drill 0.35)
  Top 0.152: FROM_FPGA_12.1 56.16,51.52 R106.1 | v82.12,59.73 85.17,62.78 137.29,62.78 139.73,65.21 139.73,67.04 139.57,67.2 139.57,67.8 139.88,68.11 150.24,68.11 160.3,58.05 160.3,55.77 159.39,54.85 159.08,54.85 J3.7
  Bottom 0.152: v82.12,59.73 82.12,56.83 73.13,47.84 66.88,47.84 64.74,49.97 64.14,49.97 62,47.84 58.34,47.84 55.45,50.74 FROM_FPGA_12.1
F8  (via drill 0.35)
  Top 0.152: FROM_FPGA_14.1 121.84,51.17 R124.1 | v123.72,47.69 123.88,47.54 140.49,47.54 147.35,54.39 158.17,54.39 158.32,54.55 158.47,54.55 158.62,54.39 158.93,54.39 J3.8
  Bottom 0.152: v123.72,47.69 121.13,50.28 FROM_FPGA_14.1
F9  (via drill 0.35)
  Top 0.152: FROM_FPGA_16.1 56.01,67.17 R142.1 | v76.48,58.51 87.45,47.54 122.96,47.54 123.42,47.08 124.03,47.08 124.18,47.23 140.64,47.23 147.5,54.09 157.71,54.09 158.01,53.78 158.47,53.78 158.62,53.94 158.93,53.94 J3.9
  Bottom 0.152: v76.48,58.51 71.45,63.54 66.73,63.54 64.59,65.67 63.98,65.67 61.85,63.54 58.04,63.54 55.3,66.28 FROM_FPGA_16.1
F10  (via drill 0.35)
  Top 0.152: FROM_FPGA_18.1 121.16,66.94 R169.1 | v157.4,53.48 158.93,53.48 J3.10
  Bottom 0.152: v157.4,53.48 147.65,63.23 131.8,63.23 129.67,65.37 129.06,65.37 126.92,63.23 123.42,63.23 120.52,66.13 FROM_FPGA_18.1
F11  (via drill 0.35)
  Top 0.152: FROM_FPGA_5.1 56.26,83.15 R43.1 | v75.72,78.32 119.76,78.32 120.68,79.23 139.57,79.23 160.6,58.2 160.6,53.63 159.84,52.87 159.69,53.02 159.54,53.02 159.39,52.87 159.08,52.87 J3.11
  Bottom 0.152: v75.72,78.32 74.65,78.32 73.89,79.08 67.49,79.08 64.9,81.67 64.29,81.67 62,79.39 58.5,79.39 FROM_FPGA_5.1
F12  (via drill 0.35)
  Top 0.152: FROM_FPGA_9.1 121.01,82.94 R79.1 | v158.01,52.72 158.01,52.56 158.32,52.26 158.47,52.26 158.62,52.41 158.93,52.41 J3.12
  Bottom 0.152: v158.01,52.72 158.01,53.78 144.91,66.89 139.88,66.89 127.53,79.23 123.27,79.23 120.37,82.13 FROM_FPGA_9.1
F13  (via drill 0.35)
  Top 0.152: FROM_FPGA_7.1 56.16,98.95 R61.1 | v152.83,53.48 154.81,51.5 158.17,51.5 158.62,51.96 158.93,51.96 J3.13 | v140.79,65.52 v143.69,62.62 | v119.46,78.93 88.21,78.93 87.91,78.63 87.3,78.63 76.48,89.45 v76.48,90.36
  Bottom 0.152: v143.69,62.62 v152.83,53.48 | v140.79,65.52 127.38,78.93 v119.46,78.93 | v76.48,90.36 76.48,92.65 73.89,95.24 66.73,95.24 64.59,97.37 63.98,97.37 61.85,95.24 58.34,95.24 FROM_FPGA_7.1
F14  (via drill 0.35)
  Top 0.152: FROM_FPGA_13.1 120.93,99.1 R115.1 | v123.72,94.78 139.12,94.78 160.91,72.99 160.91,52.41 159.84,51.35 159.08,51.35 J3.14
  Bottom 0.152: FROM_FPGA_13.1 v123.72,94.78
F15  (via drill 0.35)
  Top 0.152: FROM_FPGA_17.1 56.01,114.74 R152.1 | v149.33,53.48 151.92,50.89 158.17,50.89 158.32,51.04 158.47,51.04 158.62,50.89 158.93,50.89 J3.15 | v130.12,63.39 129.97,63.23 110.16,63.23 v109.86,63.54 | v77.39,90.36 v87.45,80.3
  Bottom 0.152: v149.33,53.48 139.88,62.93 130.58,62.93 v130.12,63.39 | v109.86,63.54 94.16,79.23 88.52,79.23 v87.45,80.3 | v77.39,90.36 77.39,93.26 74.96,95.69 74.96,96.3 76.33,97.68 76.33,110.78 76.02,111.09 67.18,111.09 64.74,113.52 63.83,113.52 61.39,111.09 58.04,111.09 55.14,113.98 FROM_FPGA_17.1
F16  (via drill 0.35)
  Top 0.152: FROM_FPGA_20.1 120.42,114.92 R187.1 | v142.93,97.83 161.21,79.54 161.21,51.8 159.69,50.28 159.54,50.28 159.39,50.43 159.08,50.43 J3.16
  Bottom 0.152: v142.93,97.83 133.93,106.82 131.95,106.82 127.53,111.24 122.66,111.24 119.76,114.13 FROM_FPGA_20.1
GND  (via drill 0.35)
  other vias: 130.58,159.79 105.94,134.9 105.94,155.73 105.94,161.82 145.57,152.68 146.08,160.05 139.22,133.63 88.42,155.35 28.17,6.79 94.51,6.62 28.24,22.42 94.23,21.98 27.97,38.01 93.93,38.21 27.97,53.81 93.65,53.45 27.81,69.46 92.96,69.23 28.07,85.43 92.81,85.23 27.97,101.23 92.74,101.38 27.81,117.03 92.23,117.21 38.28,67.09 50.57,68.41 38.68,98.97 50.83,100.19 114.78,68.26 114.63,84.29 50.88,84.44 152.02,98.08 163.83,98.11 142.75,88.23 145.64,91.91 142.19,57.21 125.76,76.7 151.61,52.54 80.65,50.28 134.9,97.07 150.7,116.17 80.82,108.88 121.46,94.78 14.5,79.9 12.75,55.03 79.58,82.13 80.29,76.47 67.11,81.42 73.63,75.4 87.58,61.05 22.48,48.73 82.68,84.16 149.28,59.5 152.22,62.24 155.32,50.05 155.91,52.82 156.64,56.5 167.21,52.77 139.4,64.02 138.61,96.1 133.68,93.51 73.38,108.47 139.98,106.11 138.99,90.79 138.61,76.75 98.73,136.56 142.39,95.01 123.62,92.54 67.08,77.79 68.22,46.39
  pour Top: 0.03,188.56 0.03,0.03 169.82,0.03 169.82,188.56
  pour Bottom: 169.82,0.03 169.82,188.59 0.03,188.59 0.03,0.03
IN_2
  Top 0.61: X2.1 155.47,175.36 U1.3 POW3.1
INPPOS1  (via drill 0.35)
  Top 0.152: 126.52,134.14 D3.C | C3.1 110.52,146.84 111.41,147.73 IC3.3 113.82,147.85 v116.1,150.14 | C10.1 110.52,174.02 111.41,174.91 IC4.3 113.31,175.29 | v130.84,168.43 130.84,168.17
  Top 0.305: 130.84,168.17 130.84,166.39 D7.C 129.82,157.25 v129.82,150.14 129.82,137.44 126.52,134.14 | 113.31,175.29 v115.34,177.32
  Top 0.406: v130.84,168.43 131.85,169.44 139.73,169.44 140.69,170.41 C18.+
  Top 0.61: U1.1 144.55,181.13 140.69,177.27 C18.+ 140.69,177.19 138.28,179.6 +V_IN1.1
  Bottom 0.305: v116.1,150.14 v129.82,150.14 | v115.34,177.32 128.3,177.32 130.84,174.78 v130.84,168.43
INV_DIR_DRAIN  (via drill 0.35)
  Top 0.152: JP_DRAIN1.1 45.69,12.38 43.84,10.53 U6.8 | JP_DRAIN3.1 112.04,12.2 110.19,10.35 U10.8 | JP_DRAIN2.1 45.77,28 43.92,26.15 U8.8 | JP_DRAIN5.1 111.76,27.57 109.91,25.72 U14.8 | JP_DRAIN7.1 45.49,43.6 43.64,41.74 U18.8 | JP_DRAIN9.1 111.46,43.8 109.6,41.95 U22.8 | JP_DRAIN11.1 45.49,59.4 43.64,57.54 U26.8 | JP_DRAIN13.1 111.18,59.04 109.32,57.19 U30.8 | JP_DRAIN15.1 45.34,75.04 43.48,73.19 U34.8 | JP_DRAIN17.1 110.49,74.82 108.64,72.96 U41.8 | JP_DRAIN4.1 45.59,91.02 43.74,89.17 U12.8 | JP_DRAIN8.1 110.34,90.82 108.48,88.96 U20.8 | JP_DRAIN6.1 45.49,106.82 43.64,104.97 U16.8 | JP_DRAIN12.1 110.26,106.97 108.41,105.12 U28.8 | JP_DRAIN16.1 45.34,122.62 43.48,120.76 U36.8 | JP_DRAIN19.1 109.75,122.8 107.9,120.94 U45.8
  Top 0.305: DRAIN_TP1.1 51.77,143.67 53.8,145.71 57.86,145.71 62.18,141.39 v65.23,141.39 | v78.18,141.39 76.91,140.12 76.91,138.91 R162.1 77.23,136.4 U38.3
  Bottom 0.152: v65.23,141.39 65.13,141.49 64.52,141.49 58.67,135.65 55.17,135.65 45.39,125.87 45.39,123.13 | 109.7,123.28 109.7,109.11 110.31,108.5 110.31,107.58 JP_DRAIN12.1 110.31,107.43 110.31,91.43 JP_DRAIN8.1 110.31,91.27 110.31,76.64 110.46,76.49 110.46,75.42 JP_DRAIN17.1 110.46,75.27 110.46,61.4 111.23,60.64 111.23,59.58 JP_DRAIN13.1 111.23,59.42 111.23,58.36 111.53,58.05 111.53,44.34 JP_DRAIN9.1 111.38,44.18 111.38,43.27 111.84,42.81 111.84,28.18 JP_DRAIN5.1 111.68,28.03 111.68,26.96 111.99,26.66 111.99,12.79 JP_DRAIN3.1 | 45.39,123.13 45.39,121.91 45.54,121.75 45.54,107.43 JP_DRAIN6.1 45.54,107.28 45.54,91.58 JP_DRAIN4.1 45.54,91.43 45.54,76.95 45.39,76.8 45.39,75.58 JP_DRAIN15.1 45.39,75.42 45.39,61.1 45.54,60.95 45.54,60.03 JP_DRAIN11.1 45.54,59.88 45.54,44.18 JP_DRAIN7.1 45.54,44.03 45.54,42.96 45.85,42.66 45.85,28.64 JP_DRAIN2.1 45.69,28.49 JP_DRAIN1.1 | 45.39,123.13 JP_DRAIN16.1 | 109.7,123.28 108.03,123.28 92.18,139.13 92.18,139.28 89.43,142.02 78.92,142.02 78.46,141.57 78.31,141.57 78.16,141.41 v78.18,141.39 | 109.7,123.28 JP_DRAIN19.1
  Bottom 0.305: v65.23,141.39 v78.18,141.39
M1  (via drill 0.35)
  Top 0.152: JP_MIPS2.1 R22.1 28.74,6.35 29.37,6.98 33.76,6.98 | 33.76,6.98 R20.2 | R21.1 33.06,7.68 33.76,6.98 | v9.12,53.48 9.12,59.73 J1.1
  Bottom 0.152: v9.12,53.48 9.12,21.48 25.27,5.32 JP_MIPS2.1
M2  (via drill 0.35)
  Top 0.152: JP_MIPS4.1 R40.1 95.09,6.17 95.72,6.8 100.1,6.8 | 100.1,6.8 R38.2 | R39.1 99.41,7.5 100.1,6.8 | v20.55,49.06 20.55,49.72 9.88,60.39 9.47,60.39 9.42,60.34 9.12,60.34 J1.2 | v23.9,47.08 73.43,47.08 v73.58,46.93
  Bottom 0.152: v20.55,49.06 22.53,47.08 v23.9,47.08 | v73.58,46.93 87.15,33.36 87.15,9.74 91.72,5.17 JP_MIPS4.1
M3  (via drill 0.35)
  Top 0.152: JP_MIPS3.1 R31.1 28.82,21.97 29.45,22.6 33.83,22.6 | 33.83,22.6 R29.2 | R30.1 33.14,23.3 33.83,22.6 | v21.16,41.44 21.21,41.49 21.21,49.62 9.88,60.95 9.12,60.95 J1.3
  Bottom 0.152: v21.16,41.44 21.16,25.29 25.43,21.02 JP_MIPS3.1
M4  (via drill 0.35)
  Top 0.152: JP_MIPS6.1 R58.1 94.81,21.54 95.44,22.17 99.82,22.17 | 99.82,22.17 R56.2 | R57.1 99.13,22.87 99.82,22.17 | v74.5,46.93 73.89,47.54 24.36,47.54 24.21,47.69 22.4,47.69 21.69,48.4 21.69,49.77 10.08,61.38 9.45,61.38 9.42,61.4 9.12,61.4 J1.4
  Bottom 0.152: v74.5,46.93 74.65,46.93 87.45,34.12 87.45,24.52 91.41,20.56 JP_MIPS6.1
M5
  Top 0.152: 33.55,38.2 29.17,38.2 28.54,37.57 R76.1 JP_MIPS8.1 23.5,36.49 23.51,36.5 8.05,51.96 8.05,61.25 8.66,61.86 8.97,61.86 J1.5 | 33.55,38.2 R74.2 | R75.1 32.86,38.89 33.55,38.2
M6  (via drill 0.35)
  Top 0.152: JP_MIPS10.1 R94.1 94.5,37.77 95.13,38.4 99.52,38.4 | 99.52,38.4 R92.2 | R93.1 98.82,39.1 99.52,38.4 | v74.5,47.84 24.51,47.84 10.03,62.32 9.12,62.32 J1.6
  Bottom 0.152: v74.5,47.84 78.92,47.84 90.04,36.72 91.11,36.72 JP_MIPS10.1
M7
  Top 0.152: 33.55,54 29.17,54 28.54,53.37 R112.1 JP_MIPS12.1 25.12,52.26 24.05,52.26 13.39,62.93 9.12,62.93 J1.7 | 33.55,54 R110.2 | R111.1 32.86,54.69 33.55,54